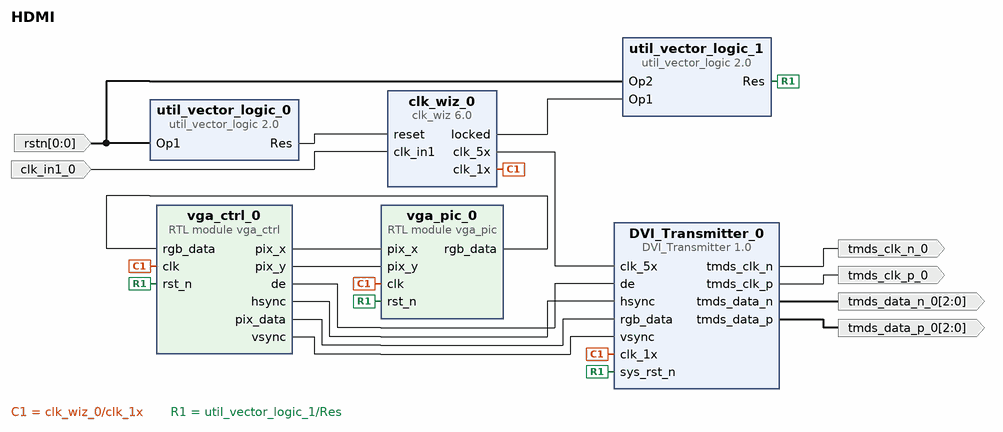
[diagram p0: block diagram of the top level]
# Vivado block design HDMI, xc7z020clg484-1, Vivado 2023.1
create_bd_design HDMI

create_bd_port -dir I -type clk clk_in1_0
set_property -dict {CONFIG.FREQ_HZ 50000000} [get_bd_ports clk_in1_0]
create_bd_port -dir I -from 0 -to 0 rstn
create_bd_port -dir O -type clk tmds_clk_n_0
create_bd_port -dir O -from 2 -to 0 tmds_data_n_0
create_bd_port -dir O -type clk tmds_clk_p_0
create_bd_port -dir O -from 2 -to 0 tmds_data_p_0

create_bd_cell -type ip -vlnv xilinx.com:user:DVI_Transmitter:1.0 DVI_Transmitter_0
create_bd_cell -type ip -vlnv xilinx.com:ip:clk_wiz:6.0 clk_wiz_0
set_property -dict [list \
  CONFIG.CLKIN1_JITTER_PS 200.0 \
  CONFIG.CLKOUT1_DRIVES BUFG \
  CONFIG.CLKOUT1_JITTER 204.383 \
  CONFIG.CLKOUT1_PHASE_ERROR 164.985 \
  CONFIG.CLKOUT1_REQUESTED_OUT_FREQ 40 \
  CONFIG.CLKOUT2_DRIVES BUFG \
  CONFIG.CLKOUT2_JITTER 142.107 \
  CONFIG.CLKOUT2_PHASE_ERROR 164.985 \
  CONFIG.CLKOUT2_REQUESTED_OUT_FREQ 200 \
  CONFIG.CLKOUT2_USED true \
  CONFIG.CLKOUT3_DRIVES BUFG \
  CONFIG.CLKOUT4_DRIVES BUFG \
  CONFIG.CLKOUT5_DRIVES BUFG \
  CONFIG.CLKOUT6_DRIVES BUFG \
  CONFIG.CLKOUT7_DRIVES BUFG \
  CONFIG.CLK_OUT1_PORT clk_1x \
  CONFIG.CLK_OUT2_PORT clk_5x \
  CONFIG.MMCM_BANDWIDTH OPTIMIZED \
  CONFIG.MMCM_CLKFBOUT_MULT_F 20 \
  CONFIG.MMCM_CLKIN1_PERIOD 20.000 \
  CONFIG.MMCM_CLKIN2_PERIOD 10.0 \
  CONFIG.MMCM_CLKOUT0_DIVIDE_F 25 \
  CONFIG.MMCM_CLKOUT1_DIVIDE 5 \
  CONFIG.MMCM_COMPENSATION ZHOLD \
  CONFIG.NUM_OUT_CLKS 2 \
  CONFIG.PLL_CLKIN_PERIOD 20.000 \
  CONFIG.PRIMITIVE PLL \
  CONFIG.PRIM_IN_FREQ 50 \
] [get_bd_cells clk_wiz_0]
create_bd_cell -type module -reference vga_ctrl vga_ctrl_0
create_bd_cell -type module -reference vga_pic vga_pic_0
create_bd_cell -type ip -vlnv xilinx.com:ip:util_vector_logic:2.0 util_vector_logic_0
set_property -dict {CONFIG.C_OPERATION not CONFIG.C_SIZE 1} [get_bd_cells util_vector_logic_0]
create_bd_cell -type ip -vlnv xilinx.com:ip:util_vector_logic:2.0 util_vector_logic_1
set_property -dict {CONFIG.C_OPERATION and CONFIG.C_SIZE 1} [get_bd_cells util_vector_logic_1]

# ---- connections ----

connect_bd_net [get_bd_pins DVI_Transmitter_0/tmds_clk_n] [get_bd_ports tmds_clk_n_0]
connect_bd_net [get_bd_pins DVI_Transmitter_0/tmds_clk_p] [get_bd_ports tmds_clk_p_0]
connect_bd_net [get_bd_pins DVI_Transmitter_0/tmds_data_n] [get_bd_ports tmds_data_n_0]
connect_bd_net [get_bd_pins DVI_Transmitter_0/tmds_data_p] [get_bd_ports tmds_data_p_0]
connect_bd_net -net Op1_0_1 [get_bd_ports rstn] [get_bd_pins util_vector_logic_0/Op1] [get_bd_pins util_vector_logic_1/Op2]
connect_bd_net -net clk_in1_0_1 [get_bd_ports clk_in1_0] [get_bd_pins clk_wiz_0/clk_in1]
connect_bd_net [get_bd_pins clk_wiz_0/clk_1x] [get_bd_pins DVI_Transmitter_0/clk_1x] [get_bd_pins vga_pic_0/clk] [get_bd_pins vga_ctrl_0/clk]
connect_bd_net [get_bd_pins clk_wiz_0/clk_5x] [get_bd_pins DVI_Transmitter_0/clk_5x]
connect_bd_net [get_bd_pins clk_wiz_0/locked] [get_bd_pins util_vector_logic_1/Op1]
connect_bd_net [get_bd_pins util_vector_logic_0/Res] [get_bd_pins clk_wiz_0/reset]
connect_bd_net [get_bd_pins util_vector_logic_1/Res] \
  [get_bd_pins vga_pic_0/rst_n] [get_bd_pins vga_ctrl_0/rst_n] [get_bd_pins DVI_Transmitter_0/sys_rst_n]
connect_bd_net [get_bd_pins vga_ctrl_0/de] [get_bd_pins DVI_Transmitter_0/de]
connect_bd_net [get_bd_pins vga_ctrl_0/hsync] [get_bd_pins DVI_Transmitter_0/hsync]
connect_bd_net [get_bd_pins vga_ctrl_0/pix_data] [get_bd_pins DVI_Transmitter_0/rgb_data]
connect_bd_net [get_bd_pins vga_ctrl_0/pix_x] [get_bd_pins vga_pic_0/pix_x]
connect_bd_net [get_bd_pins vga_ctrl_0/pix_y] [get_bd_pins vga_pic_0/pix_y]
connect_bd_net [get_bd_pins vga_ctrl_0/vsync] [get_bd_pins DVI_Transmitter_0/vsync]
connect_bd_net [get_bd_pins vga_pic_0/rgb_data] [get_bd_pins vga_ctrl_0/rgb_data]

validate_bd_design
save_bd_design
